# EAGLE design NRF24_2 (EAGLE 6.5.0)
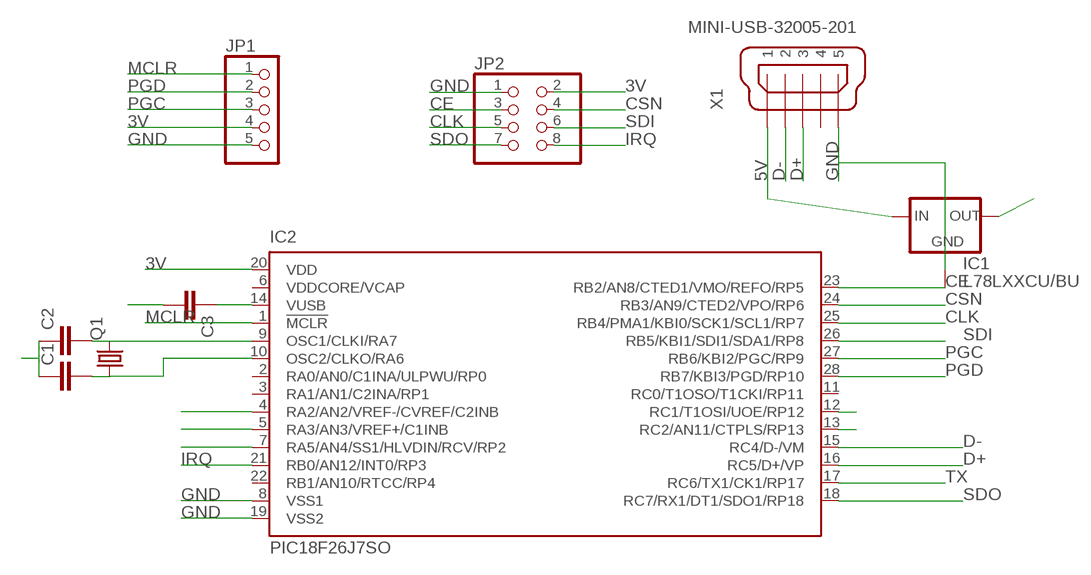
[diagram p0: schematic, sheet 1]

## Parts
C1  C-EU025-025X050  [C025-025X050]
C2  C-EU025-025X050  [C025-025X050]
C3  C-EU050-025X075  [C050-025X075]
IC1  L78LXXCU/BU  [SOT89]
IC2  PIC18F26J7SO  [SO28W]
JP1  PINHD-1X5  [1X05]
JP2  PINHD-2X4  [2X04]
Q1  CRYTALHC49S  [HC49/S]
X1  MINI-USB-32005-201  [32005-201]

## Nets
3V: IC1.1(OUT) IC2.20(VDD) JP1.4 JP2.2
5V: IC1.3(IN) X1.1
CE: IC2.23(RB2/AN8/CTED1/VMO/REFO/RP5) JP2.3
CLK: IC2.25(RB4/PMA1/KBI0/SCK1/SCL1/RP7) JP2.5
CSN: IC2.24(RB3/AN9/CTED2/VPO/RP6) JP2.4
D+: IC2.16(RC5/D+/VP) X1.3
D-: IC2.15(RC4/D-/VM) X1.2
GND: C1.1 C2.1 C3.2 IC1.2(GND) IC2.8(VSS1) IC2.19(VSS2) JP1.5 JP2.1 X1.5
IRQ: IC2.21(RB0/AN12/INT0/RP3) JP2.8
MCLR: IC2.1(!MCLR) JP1.1
N$1: IC2.13(RC2/AN11/CTPLS/RP13)
N$3: IC2.12(RC1/T1OSI/UOE/RP12)
N$4: C1.2 IC2.10(OSC2/CLKO/RA6) Q1.1
N$5: C2.2 IC2.9(OSC1/CLKI/RA7) Q1.2
N$6: C3.1 IC2.14(VUSB)
PGC: IC2.27(RB6/KBI2/PGC/RP9) JP1.3
PGD: IC2.28(RB7/KBI3/PGD/RP10) JP1.2
RA2: IC2.4(RA2/AN2/VREF-/CVREF/C2INB)
RA3: IC2.5(RA3/AN3/VREF+/C1INB)
RA5: IC2.7(RA5/AN4/SS1/HLVDIN/RCV/RP2)
SDI: IC2.26(RB5/KBI1/SDI1/SDA1/RP8) JP2.6
SDO: IC2.18(RC7/RX1/DT1/SDO1/RP18) JP2.7
TX: IC2.17(RC6/TX1/CK1/RP17)
Unconnected: IC1.4(GND1) IC2.2(RA0/AN0/C1INA/ULPWU/RP0) IC2.3(RA1/AN1/C2INA/RP1) IC2.6(VDDCORE/VCAP) IC2.11(RC0/T1OSO/T1CKI/RP11) IC2.22(RB1/AN10/RTCC/RP4) X1.4

## Library data of the parts
C1 C2 = rcl-2:C-EU: CAPACITOR, European symbol
C3 = qfm-trx1-24g:C-EU: CAPACITOR, European symbol
IC1 = v-reg-3:L78LXXCU/BU: VOLTAGE REGULATOR
IC2 = microchip-dspic:PIC18F26J*: PIC18F47J53 Family High-Performance USB Microcontrollers with nanoWatt XLP Technology Source: Data sheet <http://ww1.microchip.com/downloads/en/DeviceDoc/39964B.pdf>; MPN: PIC18F27J53-I/SO; OC_FARNELL: unknown; OC_NEWARK: 63R7838
JP1 = pinhead 2:PINHD-1X5: PIN HEADER
JP2 = pinhead 2:PINHD-2X4: PIN HEADER
Q1 = crystal 2:CRYTAL: CRYSTAL
X1 = con-cypressindustries 2:MINI-USB-: MINI USB-B Conector Source: www.cypressindustries.com

## Board
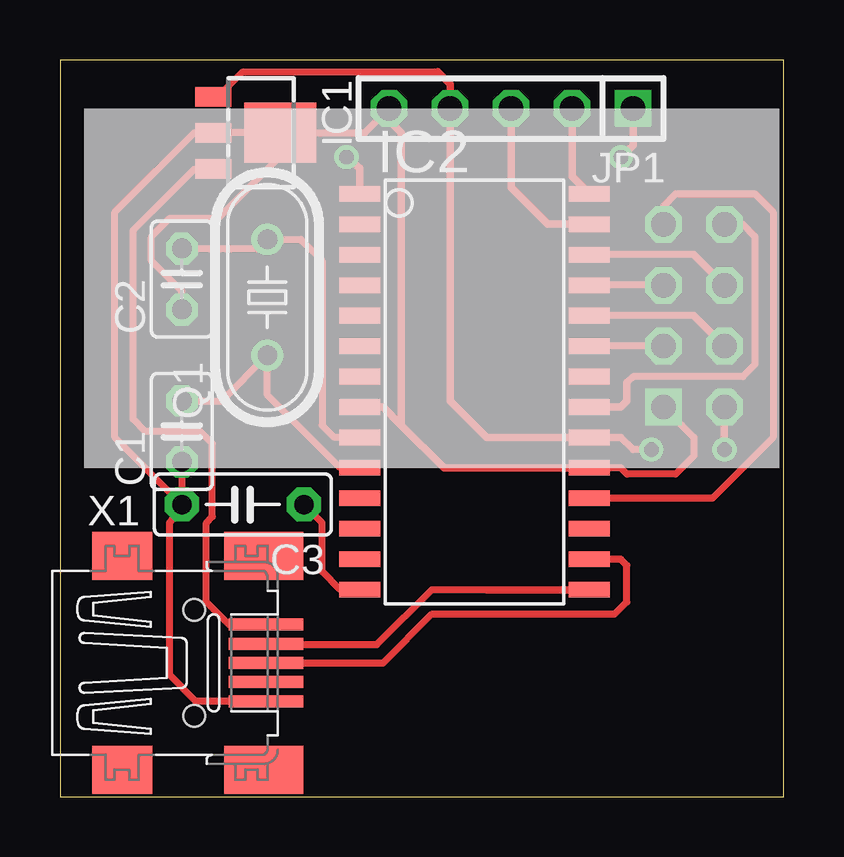
[diagram p1: board, top side]
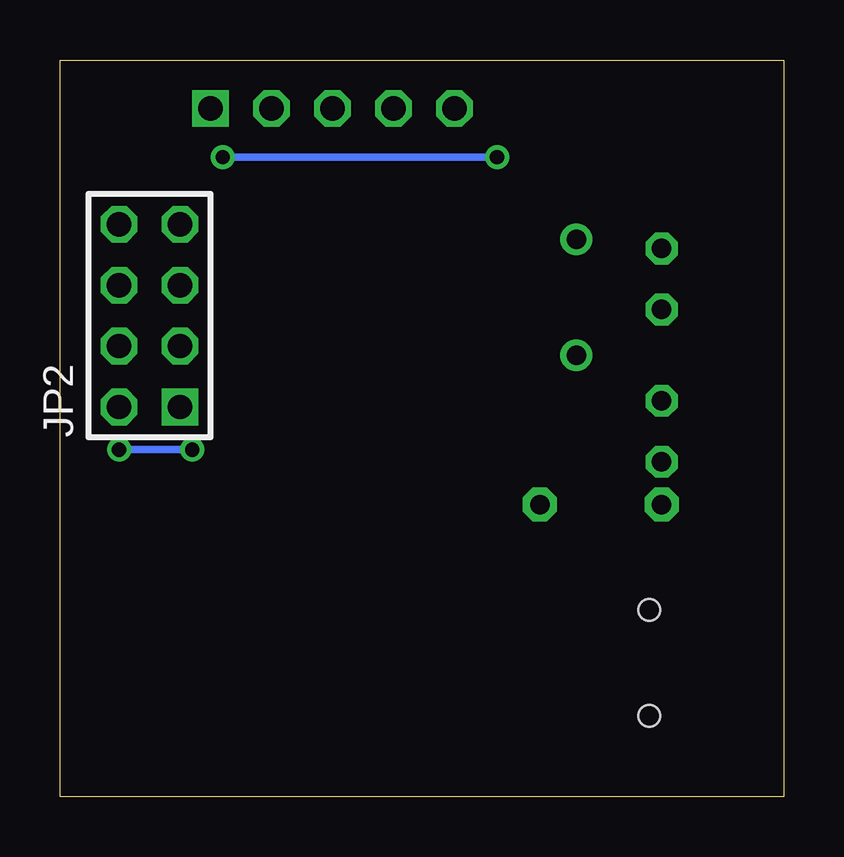
[diagram p2: board, bottom side, seen from below]

Size 30.15 x 30.72 mm. Coordinates in mm from the lower left corner, seen from the top.
Outline: 0,0 30.15,0 30.15,30.72 0,30.72 0,0
Copper layers (1*16): Top 0.035mm / dielectric 1.5mm / Bottom 0.035mm
Design rules "default": minimum track width 10mil, minimum drill 24mil, track to track 8mil, track to pad 8mil, pad to pad 8mil, via to via 8mil, smd to smd 8mil, copper to edge 40mil, drill to drill 8mil, minimum pad ring 10mil, minimum via ring 8mil, stop-mask expansion 4mil, vias tented up to drill 0mil, thermal gap 10mil

### Footprints (pad centres in the part's own frame; a part is rotated, then mirrored left to right if it is on the bottom)
C025-025X050 = drill 0.813 octagon: 1 -1.27,0; 2 1.27,0
C050-025X075 = drill 0.813 pad 1.422 octagon: 1 -2.54,0; 2 2.54,0
SOT89 = smd 0.8 x 1.5: 1 -1.5,-1.75; 2 0,-1.75; 3 1.5,-1.75 | smd 2.5 x 3: 4 0,1.05
SO28W = smd 0.65 x 1.7: 1 -7.62,-4.78; 2 -6.35,-4.78; 3 -5.08,-4.78; 4 -3.81,-4.78; 5 -2.54,-4.78; 6 -1.27,-4.78; 7 0,-4.78; 8 1.27,-4.78; 9 2.54,-4.78; 10 3.81,-4.78; 11 5.08,-4.78; 12 6.35,-4.78; 13 7.62,-4.78; 14 8.89,-4.78; 15 8.89,4.78; 16 7.62,4.78; 17 6.35,4.78; 18 5.08,4.78; 19 3.81,4.78; 20 2.54,4.78; 21 1.27,4.78; 22 0,4.78; 23 -1.27,4.78; 24 -2.54,4.78; 25 -3.81,4.78; 26 -5.08,4.78; 27 -6.35,4.78; 28 -7.62,4.78
1X05 = drill 1.016 square: 1 -5.08,0 | drill 1.016 octagon: 2 -2.54,0; 3 0,0; 4 2.54,0; 5 5.08,0
2X04 = drill 1.016 square: 1 -3.81,-1.27 | drill 1.016 octagon: 2 -3.81,1.27; 3 -1.27,-1.27; 4 -1.27,1.27; 5 1.27,-1.27; 6 1.27,1.27; 7 3.81,-1.27; 8 3.81,1.27
HC49/S = drill 0.813: 1 -2.413,0; 2 2.413,0
32005-201 = smd 3.1 x 0.5: 1 3,1.6; 2 3,0.8; 3 3,0; 4 3,-0.8; 5 3,-1.6 | smd 2.5 x 2: M1 -3,-4.45; M2 -3,4.45 | smd 3.3 x 2: M3 2.9,4.45; M4 2.9,-4.45 | hole 0.9: 0,2.2; 0,-2.2

### Placement (x,y rotation side)
C1  5.08,15.24 90 top
C2  5.08,21.59 90 top
C3  7.62,12.19 180 top
IC1  8.13,27.69 270 top
IC2  17.27,17.53 270 top
JP1  18.8,28.7 180 top
JP2  26.42,20.07 90 bottom
Q1  8.64,20.83 90 top
X1  5.59,5.59 0 top

### Tracks (layer width: path | path; a pad name or v marks a point on that pad's centre or on a via)
3V  (via drill 0.6)
  Top 0.3: v24.64,14.48 23.88,14.48 23.37,14.99 | 15.75,30.23 7.62,30.23 6.58,29.19 IC1.1
  Top 0.305: 23.37,14.99 IC2.20 17.78,14.99 16.26,16.51 JP1.4 16.26,29.72 15.75,30.23 | v27.69,14.48 JP2.2
  Bottom 0.305: v24.64,14.48 v27.69,14.48
5V
  Top 0.3: X1.1 7.04,7.19 6.1,8.13 6.1,11.43 6.35,11.68 6.35,14.73 5.84,15.24 3.56,15.24 3.05,15.75 3.05,23.62 5.59,26.16 6.35,26.16 IC1.3
CE
  Top 0.3: JP2.3 IC2.23
CLK
  Top 0.3: JP2.5 IC2.25
CSN
  Top 0.3: 26.42,20.07 IC2.24
  Top 0.305: JP2.4 26.42,20.07
D+
  Top 0.3: X1.3 13.46,5.59 15.49,7.62 23.11,7.62 23.62,8.13 23.62,9.65 23.37,9.91 IC2.16
D-
  Top 0.3: 17.78,8.64 15.49,8.64 13.21,6.35 8.63,6.35 X1.2
  Top 0.305: IC2.15 17.78,8.64
GND
  Top 0.3: 25.91,15.49 JP2.1 26.42,14.99 26.42,14.22 25.65,13.46 23.62,13.46 23.37,13.72 IC2.19 | X1.5 5.66,3.99 4.57,5.08 4.57,11.43 C3.2 | C3.2 2.29,14.99 2.29,24.38 5.59,27.69 IC1.2 10.16,27.69 | C2.1 5.08,21.08 3.81,22.35 3.81,23.37 4.57,24.13 6.6,24.13 10.16,27.69 | 10.16,27.69 12.7,27.69 JP1.5 | C1.1 C3.2
  Top 0.305: IC2.19 16,13.72 14.22,15.49 | 14.22,15.49 13.46,16.26 IC2.8 | JP1.5 13.72,28.19 14.22,27.69 14.22,15.49
IRQ
  Top 0.3: JP2.8 28.45,23.88 28.96,23.37 28.96,18.03 28.45,17.53 23.88,17.53 23.62,17.27
  Top 0.305: IC2.21 23.37,16.26 23.62,16.51 23.62,17.27
MCLR  (via drill 0.6)
  Top 0.305: IC2.1 12.49,26.21 v11.94,26.67 | JP1.1 23.88,27.18 v23.37,26.67
  Bottom 0.305: v11.94,26.67 v23.37,26.67
N$4
  Top 0.3: IC2.10 11.68,13.72 8.64,16.76 Q1.1 6.73,16.51 C1.2
N$5
  Top 0.3: IC2.9 11.43,14.99 10.92,15.49 10.92,22.35 10.03,23.24 Q1.2 8.26,22.86 C2.2
N$6
  Top 0.3: 12.45,8.59 IC2.14 11.68,8.64 10.92,9.4 10.92,11.43 C3.1
PGC
  Top 0.305: JP1.3 18.8,25.4 20.32,23.88 IC2.27
PGD
  Top 0.305: JP1.2 21.34,25.86 IC2.28
SDI
  Top 0.3: 26.42,22.61 IC2.26
  Top 0.305: JP2.6 26.42,22.61
SDO
  Top 0.3: 25.15,24.64 25.65,25.15 28.96,25.15 29.72,24.38 29.72,14.99 27.18,12.45 IC2.18
  Top 0.305: 25.15,24.64 JP2.7